# EasyEDA schematic uvir-carrier-r1-easyeda-standard-schematic.json
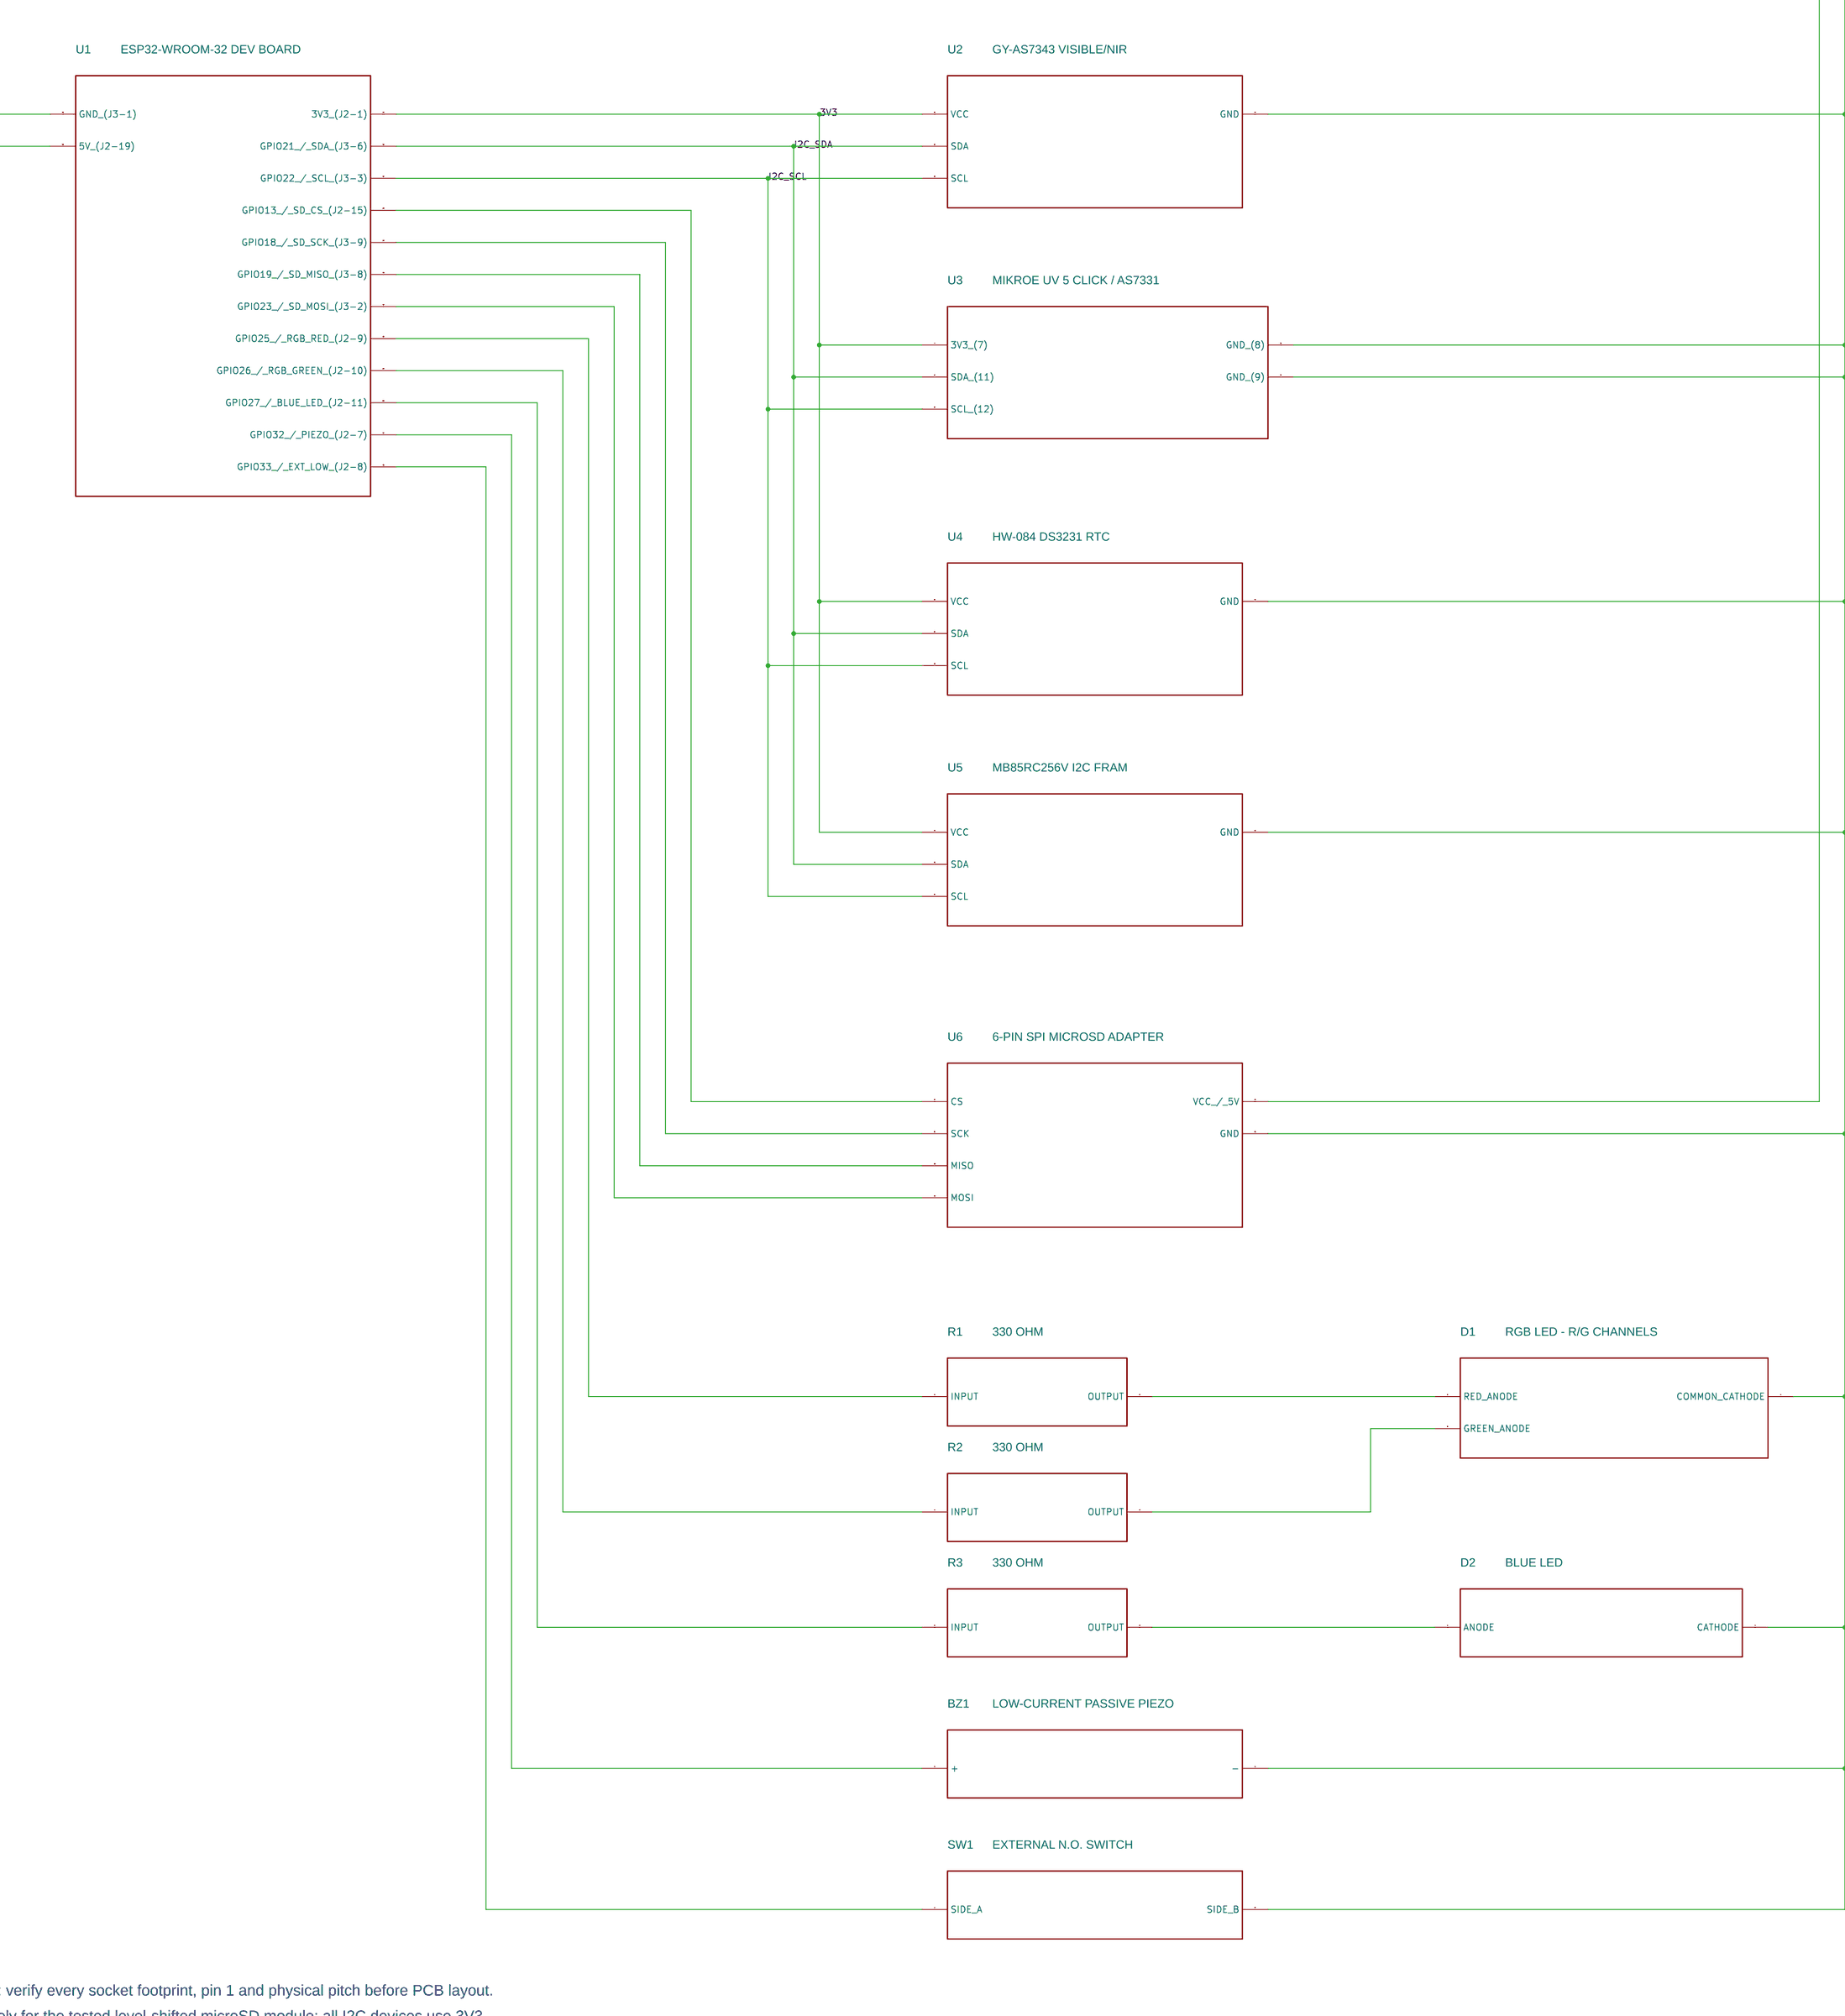
[diagram p0: schematic sheet]

## Parts
BZ1  LOW-CURRENT PASSIVE PIEZO
D1  RGB LED - R/G CHANNELS
D2  BLUE LED
R1  330 OHM
R2  330 OHM
R3  330 OHM
SW1  EXTERNAL N.O. SWITCH
U1  ESP32-WROOM-32 DEV BOARD
U2  GY-AS7343 VISIBLE/NIR
U3  MIKROE UV 5 CLICK / AS7331
U4  HW-084 DS3231 RTC
U5  MB85RC256V I2C FRAM
U6  6-PIN SPI MICROSD ADAPTER

## Nets
3V3: U1.J2-1(3V3 (J2-1)) U2.VCC U3.7(3V3 (7)) U4.VCC U5.VCC
5V_USB: U1.J2-19(5V (J2-19)) U6.VCC(VCC / 5V)
GND: BZ1.2(-) D1.K(COMMON CATHODE) D2.K(CATHODE) SW1.B(SIDE B) U1.J3-1(GND (J3-1)) U2.GND U3.8(GND (8)) U3.9(GND (9)) U4.GND U5.GND U6.GND
I2C_SCL: U1.J3-3(GPIO22 / SCL (J3-3)) U2.SCL U3.12(SCL (12)) U4.SCL U5.SCL
I2C_SDA: U1.J3-6(GPIO21 / SDA (J3-6)) U2.SDA U3.11(SDA (11)) U4.SDA U5.SDA
Net-(BZ1-1): BZ1.1(+) U1.J2-7(GPIO32 / PIEZO (J2-7))
Net-(D1-G): D1.G(GREEN ANODE) R2.2(OUTPUT)
Net-(D1-R): D1.R(RED ANODE) R1.2(OUTPUT)
Net-(D2-A): D2.A(ANODE) R3.2(OUTPUT)
Net-(R1-1): R1.1(INPUT) U1.J2-9(GPIO25 / RGB RED (J2-9))
Net-(R2-1): R2.1(INPUT) U1.J2-10(GPIO26 / RGB GREEN (J2-10))
Net-(R3-1): R3.1(INPUT) U1.J2-11(GPIO27 / BLUE LED (J2-11))
Net-(SW1-A): SW1.A(SIDE A) U1.J2-8(GPIO33 / EXT LOW (J2-8))
Net-(U1-J2-15): U1.J2-15(GPIO13 / SD CS (J2-15)) U6.CS
Net-(U1-J3-2): U1.J3-2(GPIO23 / SD MOSI (J3-2)) U6.MOSI
Net-(U1-J3-8): U1.J3-8(GPIO19 / SD MISO (J3-8)) U6.MISO
Net-(U1-J3-9): U1.J3-9(GPIO18 / SD SCK (J3-9)) U6.SCK

## Notes on the sheet
- UVIR CARRIER R1 - CONNECTED ELECTRICAL SCHEMATIC
- ESP32 header labels J2/J3 correspond to the USB-down 38-pin reference.
- Green lines are continuous wires; red dots are intentional branch junctions.
- SCHEMATIC ONLY: verify every socket footprint, pin 1 and physical pitch before PCB layout.
- 5V_USB is exclusively for the tested level-shifted microSD module; all I2C devices use 3V3.
- Check I2C pull-ups, regulator budget, antenna clearance, optical shielding and RTC charging path.
- SW1 uses opposite contact sides; GPIO33 is active LOW. R1/R2/R3 = 330 ohm.
